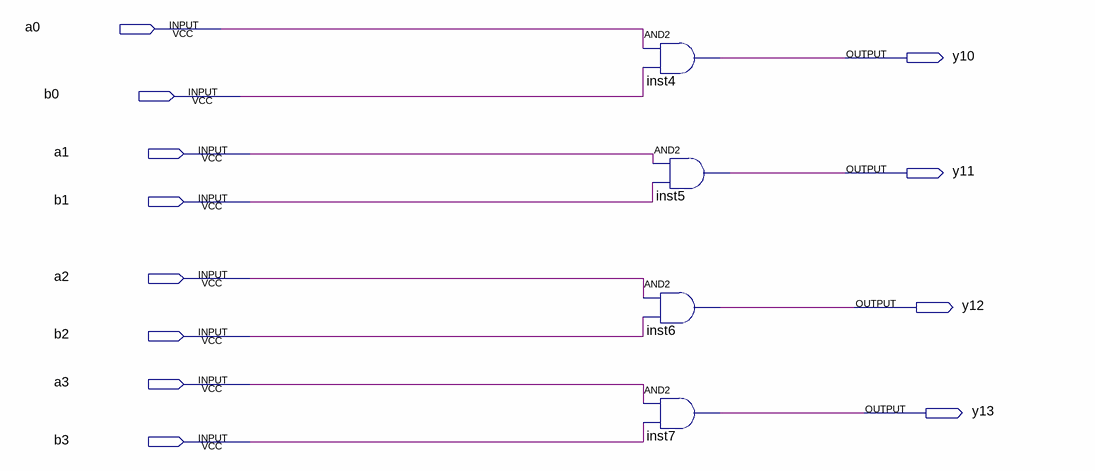
[diagram p0: schematic sheet]
// Quartus schematic AND.bdf as structural Verilog: 4 symbols, 12 pins
module AND (
  input  a0,
  input  b0,
  input  a1,
  input  b1,
  input  a2,
  input  b2,
  input  a3,
  input  b3,
  output y10,
  output y11,
  output y12,
  output y13
);

  and inst4 (y10, a0, b0);
  and inst5 (y11, a1, b1);
  and inst6 (y12, a2, b2);
  and inst7 (y13, a3, b3);
endmodule
